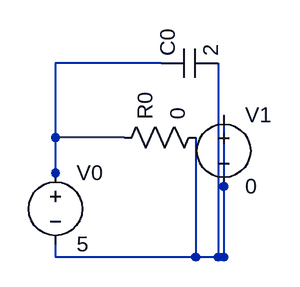
[diagram p0: schematic a.asc]
a.asc, the LTspice schematic file:
Version 4
SHEET 1 880 680
WIRE 295 230 177 230
WIRE 359 230 359 447
WIRE 177 353 177 353
WIRE 177 433 177 447
WIRE 365 288 365 447
WIRE 365 368 365 447
WIRE 254 313 177 313
WIRE 334 313 334 447
WIRE 177 230 177 353
WIRE 177 447 365 447
SYMBOL cap 295 246 R270
SYMATTR InstName C0
SYMATTR Value 2
SYMBOL voltage 177 337 R0
SYMATTR InstName V0
SYMATTR Value 5
SYMBOL voltage 365 272 R0
SYMATTR InstName V1
SYMATTR Value 0
SYMBOL res 238 329 R270
SYMATTR InstName R0
SYMATTR Value 0

The netlist it stands for:
* a.asc
C0 N001 N002 2
V0 N001 N002 5
V1 N002 N002 0
R0 N001 N002 0
.backanno
.end